# EAGLE design Pi-Display (EAGLE 7.4.0)
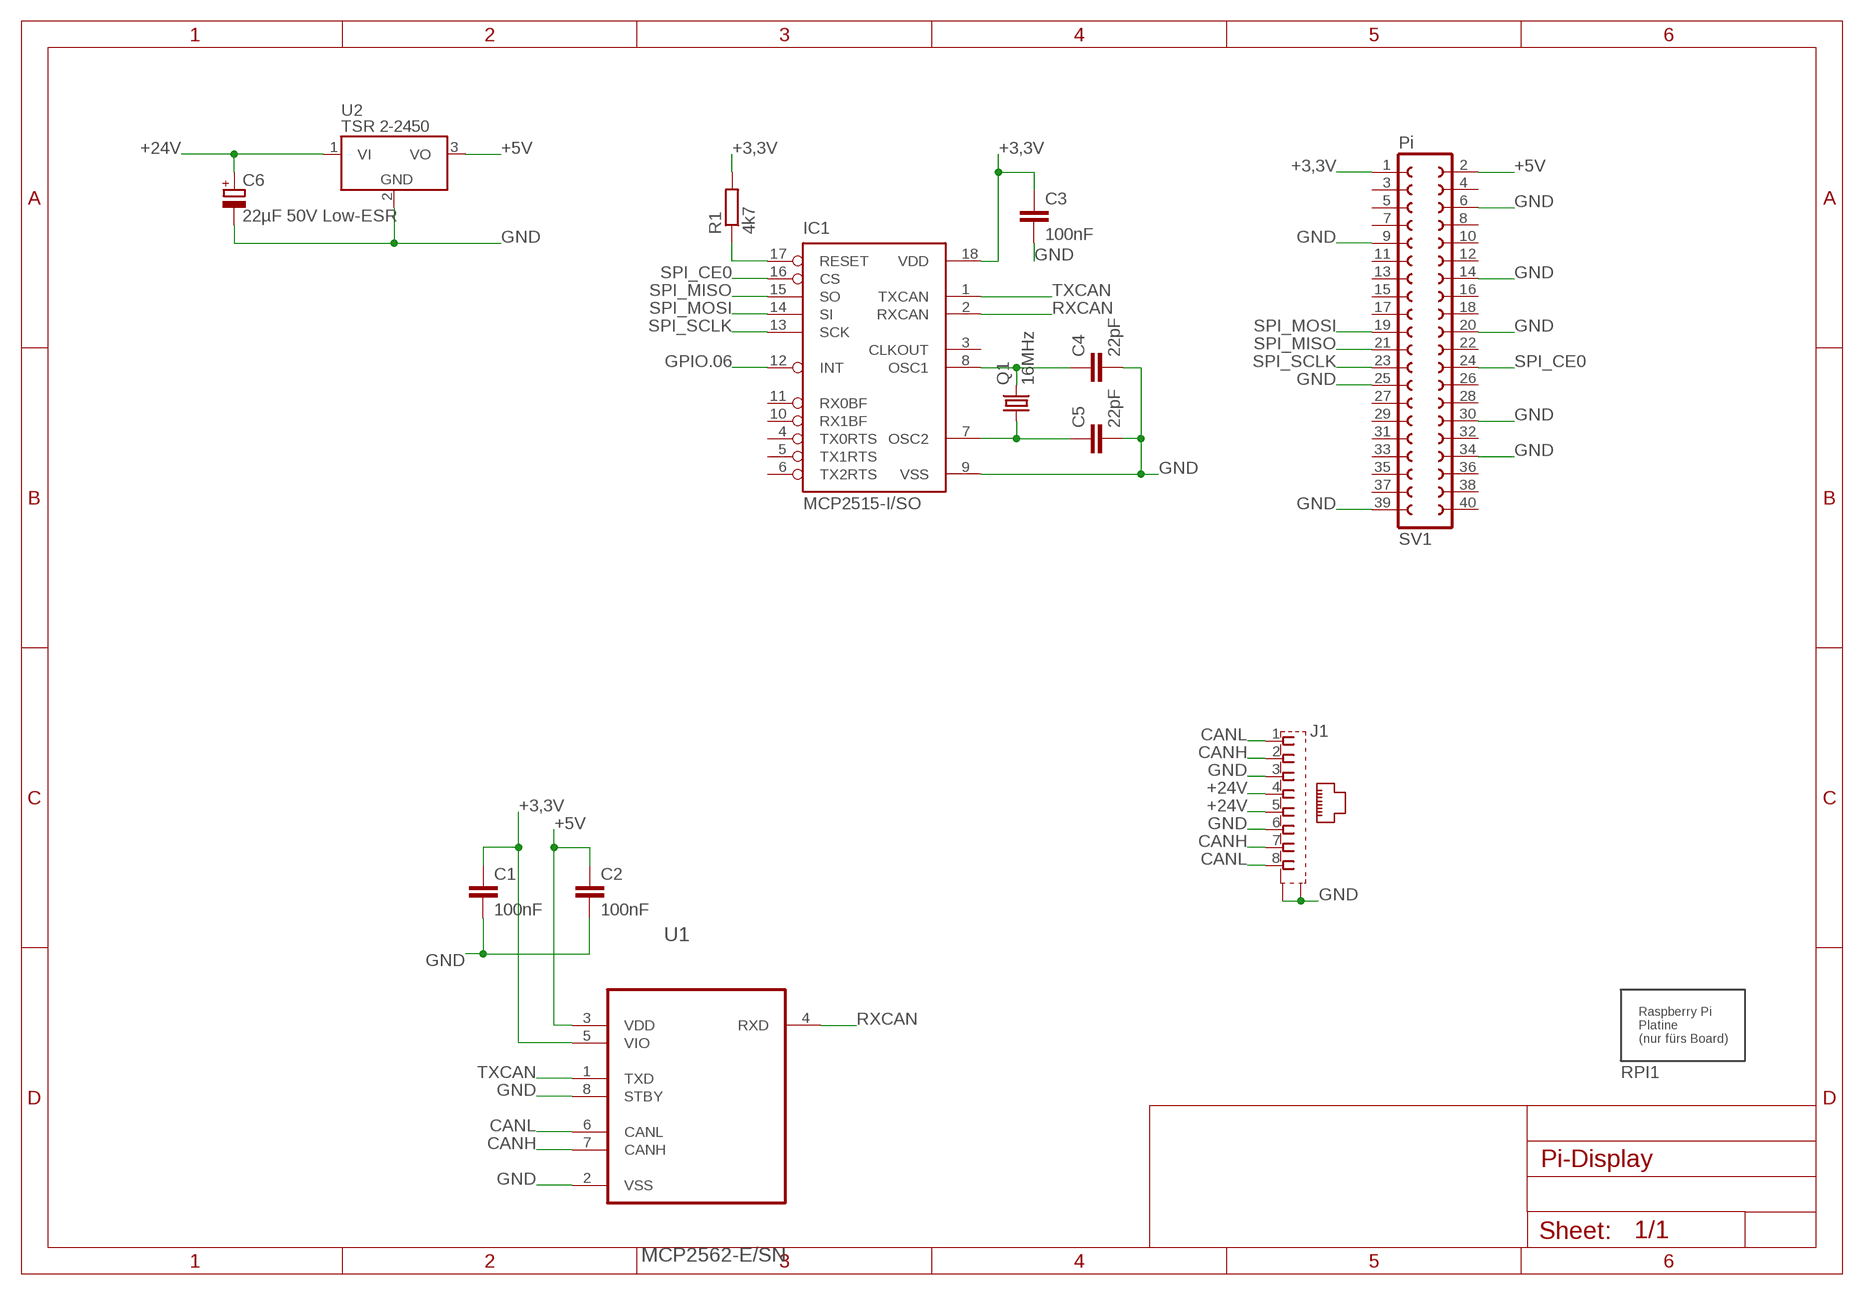
[diagram p0: schematic, sheet 1]

## Parts
C1  100nF  C-EUC1206  [C1206]
C2  100nF  C-EUC1206  [C1206]
C3  100nF  C-EUC1206  [C1206]
C4  22pF  C-EUC1206  [C1206]
C5  22pF  C-EUC1206  [C1206]
C6  22µF 50V Low-ESR  CPOL-EUE2-5  [E2-5]
IC1  MCP2515-I/SO  [SO18L]
J1  555141-1  [MEBP_8-8G]
Q1  16MHz  CRYSTALHC49UP  [HC49UP]
R1  4k7  R-EU_R1206  [R1206]
RPI1  RASPBERRYPI-PLATINE  [RASPBERRYPI-PLATINE]
SV1  Pi  FE20-2  [FE20-2]
U1  MCP2562-E/SN  [SO08]
U2  TSR 2-2450  TSR_1-2450  [TSR-1]

## Nets
+3,3V: C1.1 C3.1 IC1.18(VDD) R1.2 SV1.1 U1.5(VIO)
+5V: C2.1 SV1.2 U1.3(VDD) U2.3(VO)
+24V: C6.+ J1.4 J1.5 U2.1(VI)
CANH: J1.2 J1.7 U1.7(CANH)
CANL: J1.1 J1.8 U1.6(CANL)
GND: C1.2 C2.2 C3.2 C4.2 C5.2 C6.- IC1.9(VSS) J1.3 J1.6 J1.G1(S1) J1.G2(S2) SV1.6 SV1.9 SV1.14 SV1.20 SV1.25 SV1.30 SV1.34 SV1.39 U1.2(VSS) U1.8(STBY) U2.2(GND)
GPIO.06: IC1.12(INT)
N$1: C4.1 IC1.8(OSC1) Q1.2
N$2: IC1.17(RESET) R1.1
N$4: C5.1 IC1.7(OSC2) Q1.1
RXCAN: IC1.2(RXCAN) U1.4(RXD)
SPI_CE0: IC1.16(CS) SV1.24
SPI_MISO: IC1.15(SO) SV1.21
SPI_MOSI: IC1.14(SI) SV1.19
SPI_SCLK: IC1.13(SCK) SV1.23
TXCAN: IC1.1(TXCAN) U1.1(TXD)
Unconnected: IC1.3(CLKOUT) IC1.4(TX0RTS) IC1.5(TX1RTS) IC1.6(TX2RTS) IC1.10(RX1BF) IC1.11(RX0BF) SV1.3 SV1.4 SV1.5 SV1.7 SV1.8 SV1.10 SV1.11 SV1.12 SV1.13 SV1.15 SV1.16 SV1.17 SV1.18 SV1.22 SV1.26 SV1.27 SV1.28 SV1.29 SV1.31 SV1.32 SV1.33 SV1.35 SV1.36 SV1.37 SV1.38 SV1.40

## Library data of the parts
C1-C5 = rcl:C-EU: CAPACITOR, European symbol
C6 = rcl:CPOL-EU: POLARIZED CAPACITOR, European symbol
IC1 = mcp2515_2551_2562:MCP2515
J1 = mebp_8-8g:555141-1: AMP connector Reichelt Bestell-Nr. MEBP 8-8G
Q1 = crystal:CRYSTAL: CRYSTAL; OC_FARNELL: unknown; OC_NEWARK: unknown
R1 = rcl:R-EU_: RESISTOR, European symbol
RPI1 = homepi:RASPBERRYPI-PLATINE: Platine des Raspberry Pi B+/2B Nur als Package für ein Board-Layout.
SV1 = con-lsta:FE20-2: FEMALE HEADER; OC_FARNELL: unknown; OC_NEWARK: unknown
U1 = mcp2515_2551_2562:MCP2562: High-Speed CAN Transceiver,DIP-8
U2 = _traco_tsr-1:TSR_1-*: TRACO TSR-1 Series Point-of-Load DC/DC-Converters Vi max. 36 V; Vo = (1.2 .. 15)V ±2%; Io = 0 .. 1 A SIP-Package (drop-in replacement for 78xx linear voltage regulators in TO220-package, vertically assembled) Source: www.tracopower.com Technologies: TSR 1- Vi (V) Vo (V) ±2% Io = 0 .. 1 A 24_ ( generic ) 2412 4.6 .. 36 1.2 2415 4.6 .. 36 1.5 2418 4.6 .. 36 1.8 2425 4.6 .. 36 2.5 2433 4.75.. 36 3.3 2450 6.5 .. 36 5.0 2465 9.0 .. 36 6.5 2490 12 .. 36 9.0 24120 15 .. 36 12 24150 18 .. 36 15 Author: Dipl.-Ing. FH Rainer Bayer HHN Hochschule Heilbronn, rainer.bayer@hs-heilbronn.de Ingenieurbüro ing-rb, mail@ing-rb.de

## Board
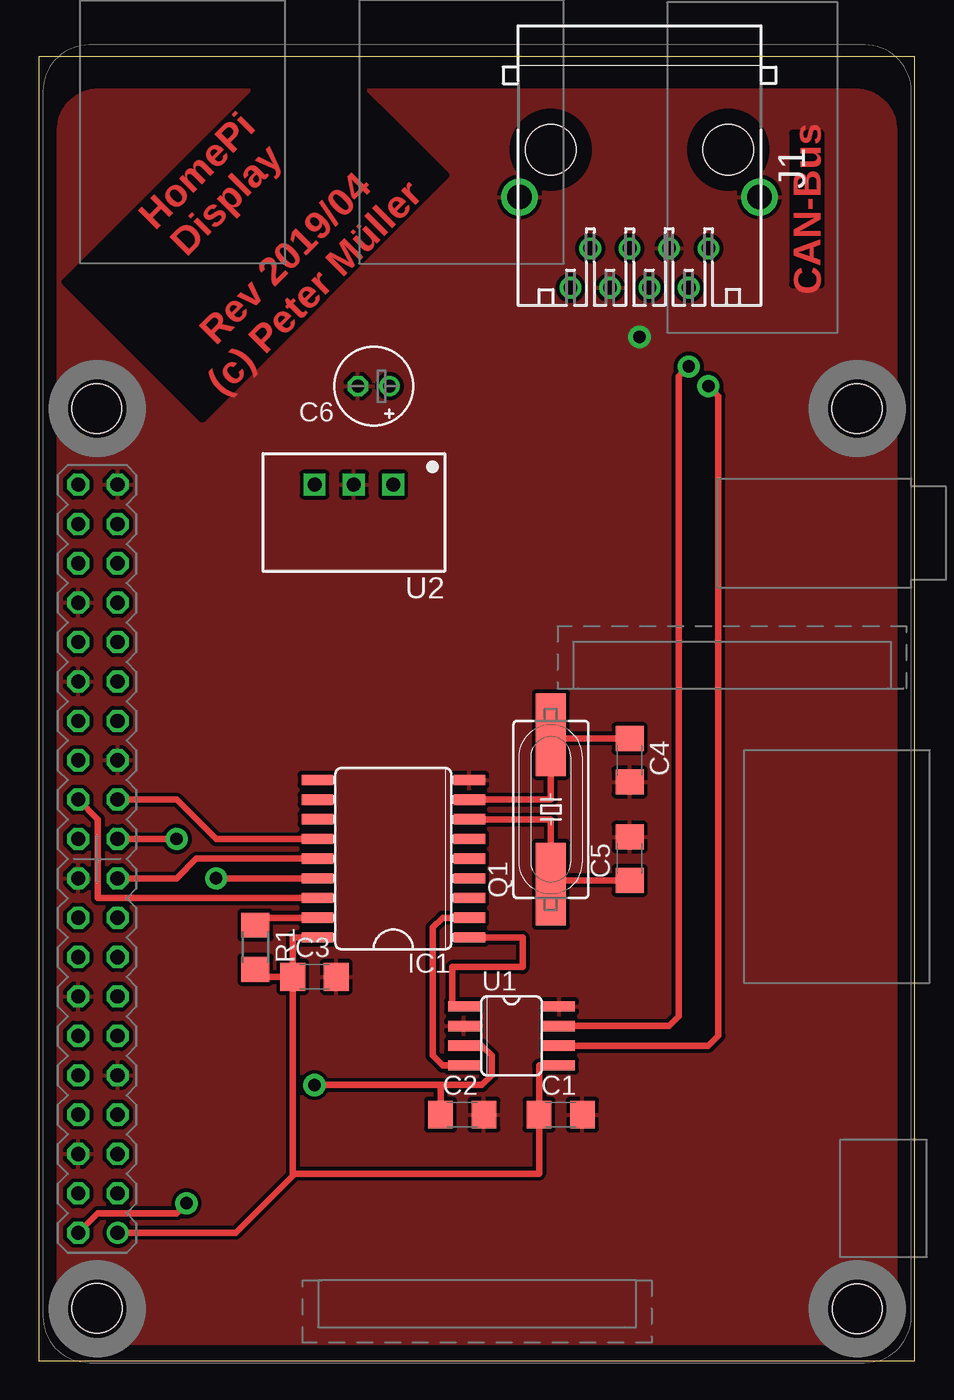
[diagram p1: board, top side]
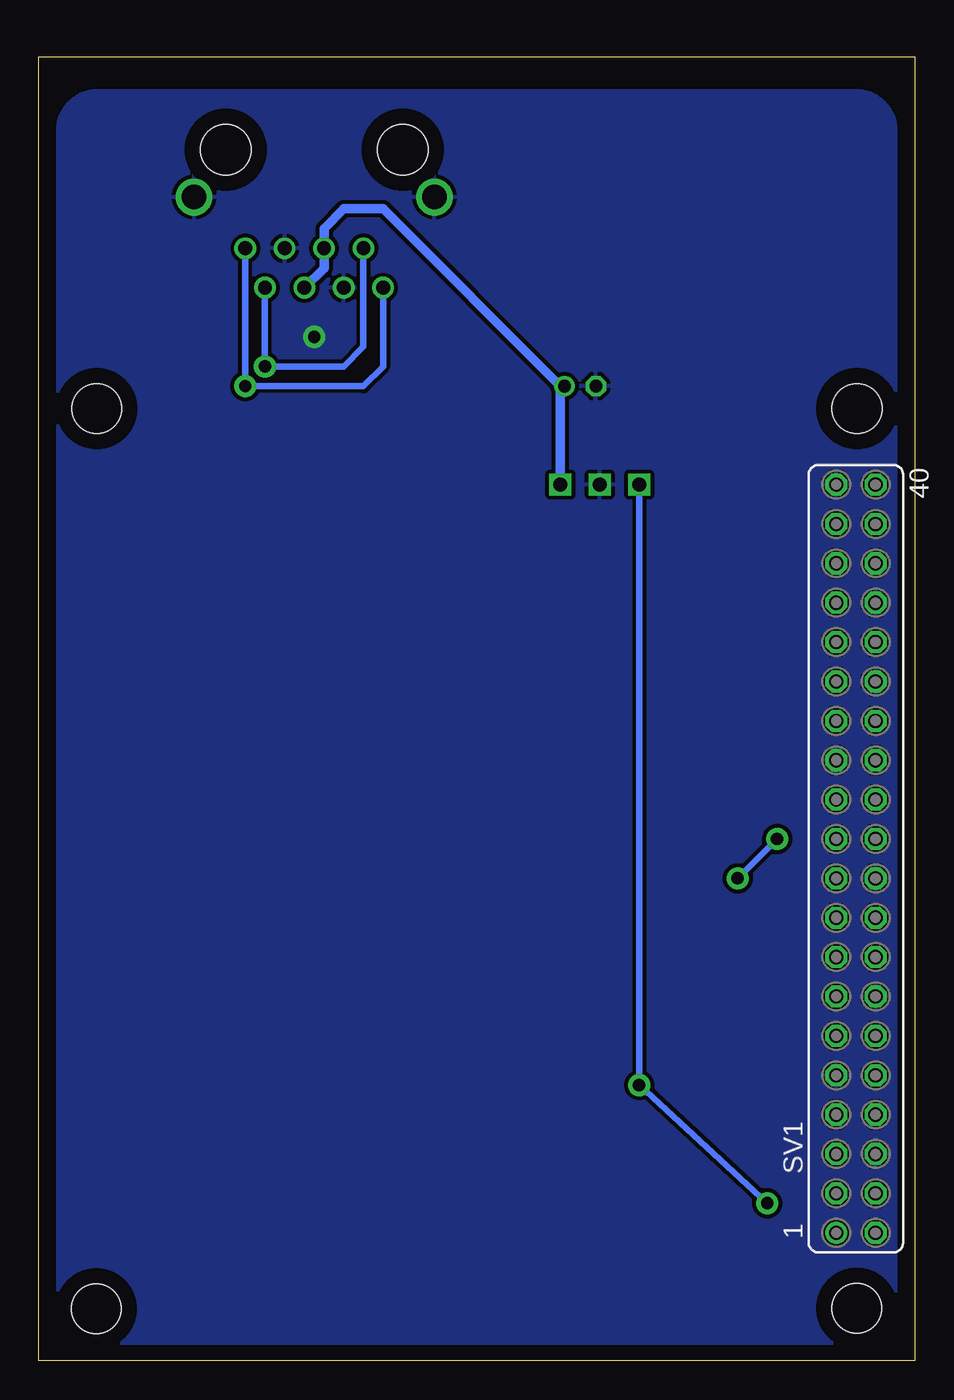
[diagram p2: board, bottom side, seen from below]

Size 56.49 x 84.12 mm. Coordinates in mm from the lower left corner, seen from the top.
Outline: 0,0 56.49,0 56.49,84.12 0,84.12 0,0
Copper layers (1*16): Top 0.035mm / dielectric 1.5mm / Bottom 0.035mm
Design rules "platinenbelichter": minimum track width 10mil, minimum drill 24mil, track to track 10mil, track to pad 10mil, pad to pad 10mil, via to via 10mil, smd to smd 10mil, copper to edge 40mil, drill to drill 8mil, minimum pad ring 10mil, minimum via ring 8mil, stop-mask expansion 10mil, vias tented up to drill 0mil, thermal gap 10mil
Holes 3.2 mm at 3.76,3.38 52.78,3.35 52.76,61.42 3.73,61.42

### Footprints (pad centres in the part's own frame; a part is rotated, then mirrored left to right if it is on the bottom)
C1206 = smd 1.6 x 1.8: 1 -1.4,0; 2 1.4,0
E2-5 = drill 0.813 pad 1.27: + -1.016,0 | drill 0.813 pad 1.27 octagon: - 1.016,0
SO18L = smd 0.66 x 2.032: 1 -5.08,-4.902; 2 -3.81,-4.902; 3 -2.54,-4.902; 4 -1.27,-4.902; 5 0,-4.902; 6 1.27,-4.902; 7 2.54,-4.902; 8 3.81,-4.902; 9 5.08,-4.902; 10 5.08,4.902; 11 3.81,4.902; 12 2.54,4.902; 13 1.27,4.902; 14 0,4.902; 15 -1.27,4.902; 16 -2.54,4.902; 17 -3.81,4.902; 18 -5.08,4.902
MEBP_8-8G = drill 0.889: 1 -4.445,6.35; 2 -3.175,8.89; 3 -1.905,6.35; 4 -0.635,8.89; 5 0.635,6.35; 6 1.905,8.89; 7 3.175,6.35; 8 4.445,8.89 | drill 1.575 pad 2.184: G1 -7.745,3.05; G2 7.745,3.05 | hole 3.251: -5.715,0; 5.715,0
HC49UP = smd 5.334 x 1.93: 1 -4.826,0; 2 4.826,0
R1206 = smd 1.6 x 1.803: 1 -1.422,0; 2 1.422,0
FE20-2 = drill 0.914: 1 -24.13,1.27 | drill 0.914 octagon: 2 -24.13,-1.27; 3 -21.59,1.27; 4 -21.59,-1.27; 5 -19.05,1.27; 6 -19.05,-1.27; 7 -16.51,1.27; 8 -16.51,-1.27; 9 -13.97,1.27; 10 -13.97,-1.27; 11 -11.43,1.27; 12 -11.43,-1.27; 13 -8.89,1.27; 14 -8.89,-1.27; 15 -6.35,1.27; 16 -6.35,-1.27; 17 -3.81,1.27; 18 -3.81,-1.27; 19 -1.27,1.27; 20 -1.27,-1.27; 21 1.27,1.27; 22 1.27,-1.27; 23 3.81,1.27; 24 3.81,-1.27; 25 6.35,1.27; 26 6.35,-1.27; 27 8.89,1.27; 28 8.89,-1.27; 29 11.43,1.27; 30 11.43,-1.27; 31 13.97,1.27; 32 13.97,-1.27; 33 16.51,1.27; 34 16.51,-1.27; 35 19.05,1.27; 36 19.05,-1.27; 37 21.59,1.27; 38 21.59,-1.27; 39 24.13,1.27; 40 24.13,-1.27
SO08 = smd 0.66 x 2.032: 1 -1.905,-3.073; 2 -0.635,-3.073; 3 0.635,-3.073; 4 1.905,-3.073; 5 1.905,3.073; 6 0.635,3.073; 7 -0.635,3.073; 8 -1.905,3.073
TSR-1 = drill 0.9 square: 1 -2.54,0; 2 0,0; 3 2.54,0

### Placement (x,y rotation side)
C1  33.66,15.88 0 top
C2  27.3,15.88 0 top
C3  17.78,24.76 0 top
C4  38.1,38.73 270 top
C5  38.1,32.39 90 top
C6  21.59,62.87 180 top
IC1  22.86,32.39 90 top
J1  38.73,78.1 180 top
Q1  33.02,35.56 90 top
R1  13.97,26.67 270 top
RPI1  56.26,-0.13 90 top
SV1  3.81,32.39 90 bottom
U1  30.48,20.95 270 top
U2  20.32,56.52 180 top

### Tracks (layer width: path | path; a pad name or v marks a point on that pad's centre or on a via)
+3,3V
  Top 0.406: U1.5 32.26,19.05 C1.1 32.26,12.06 16.38,12.06 | C3.1 16.38,12.06 | IC1.18 16.38,27.3 C3.1 | 16.38,12.06 16.38,11.94 12.7,8.26 SV1.1 | R1.2 14.45,24.76 C3.1
+5V  (via drill 0.8 pad 1.42)
  Top 0.406: U1.3 28.57,20.32 29.21,19.68 29.21,18.41 28.57,17.78 25.91,17.78 | C2.1 25.91,17.78 | v17.78,17.78 25.91,17.78 | SV1.2 3.81,9.53 8.89,9.53 v9.53,10.16
  Bottom 0.406: U2.3 v17.78,17.78 v9.53,10.16
+24V
  Bottom 0.61: J1.4 38.1,70.48 J1.5 38.1,73.02 36.83,74.3 34.29,74.3 22.86,62.87 C6.+ 22.86,62.61 U2.1
CANH  (via drill 0.8 pad 1.42)
  Top 0.406: U1.7 40.64,21.59 41.27,22.22 41.27,63.5 v41.91,64.13
  Bottom 0.406: J1.2 v41.91,64.13 36.83,64.13 35.56,65.41 J1.7
CANL  (via drill 0.8 pad 1.42)
  Top 0.406: U1.6 43.18,20.32 43.81,20.95 43.81,62.23 v43.18,62.87
  Bottom 0.406: J1.1 v43.18,62.87 35.56,62.87 34.29,64.13 J1.8
GND  (via drill 0.8 pad 1.42)
  other vias: 38.73,66.04
  pour Bottom: 1.27,3.17 arc90 3.81,0.64 52.7,0.64 arc90 55.24,3.17 55.24,79.38 arc90 52.7,81.91 3.81,81.91 arc90 1.27,79.38
  pour Top: 1.27,3.17 arc90 3.81,0.64 52.7,0.64 arc90 55.24,3.17 55.24,79.38 arc90 52.7,81.91 3.81,81.91 arc90 1.27,79.38
N$1
  Top 0.406: IC1.8 33.02,36.2 Q1.2 33.02,40.14 C4.1
N$2
  Top 0.406: IC1.17 13.97,28.57 R1.1
N$4
  Top 0.406: IC1.7 33.02,34.93 Q1.1 33.02,30.98 C5.1
RXCAN
  Top 0.406: IC1.2 26.04,28.57 25.4,27.94 25.4,19.68 26.04,19.05 U1.4
SPI_CE0
  Top 0.406: SV1.24 3.81,34.93 3.81,29.84 IC1.16
SPI_MISO  (via drill 0.8 pad 1.42)
  Top 0.406: SV1.21 v8.89,33.66 | v11.43,31.11 IC1.15
  Bottom 0.406: v8.89,33.66 v11.43,31.11
SPI_MOSI
  Top 0.406: SV1.19 8.89,31.11 10.16,32.39 IC1.14
SPI_SCLK
  Top 0.406: SV1.23 8.89,36.2 11.43,33.66 IC1.13
TXCAN
  Top 0.406: IC1.1 31.2,27.3 31.2,25.4 26.67,25.4 26.67,22.86 U1.1

### Text on the board
Top: CAN-Bus | HomePi / Display / / Rev 2019/04 / (c) Peter Müller